# Altium schematic sheet ECU_AutoRC_STEMP_r00.SchDoc
size A4; SheetNumber: 5; SheetTotal: 9
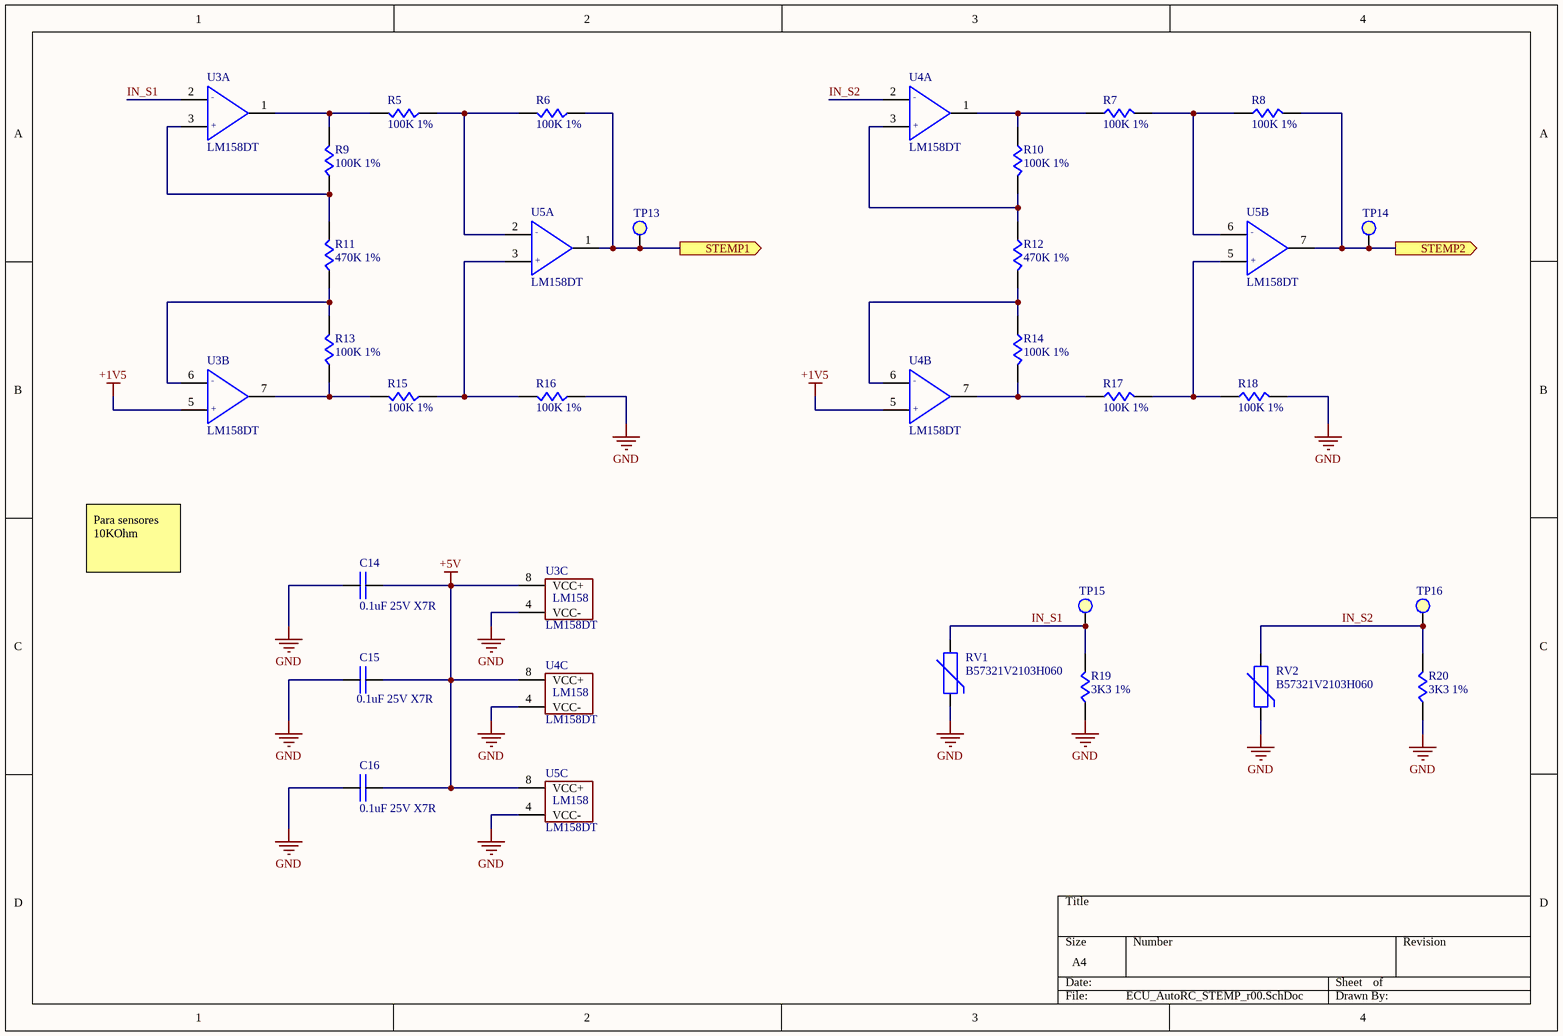
[diagram p0: ECU_AutoRC_STEMP_r00.SchDoc]

## Parts
C14  0.1uF 25V X7R  [C_0805]
C15  0.1uF 25V X7R  [C_0805]
C16  0.1uF 25V X7R  [C_0805]
R5  100K 1%  [R_0805]
R6  100K 1%  [R_0805]
R7  100K 1%  [R_0805]
R8  100K 1%  [R_0805]
R9  100K 1%  [R_0805]
R10  100K 1%  [R_0805]
R11  470K 1%  [R_0805]
R12  470K 1%  [R_0805]
R13  100K 1%  [R_0805]
R14  100K 1%  [R_0805]
R15  100K 1%  [R_0805]
R16  100K 1%  [R_0805]
R17  100K 1%  [R_0805]
R18  100K 1%  [R_0805]
R19  3K3 1%  [R_0805]
R20  3K3 1%  [R_0805]
RV1  B57321V2103H060  [R_0603]
RV2  B57321V2103H060  [R_0603]
TP13  Test Point  [TEST_POINT]  (value not drawn)
TP14  Test Point  [TEST_POINT]  (value not drawn)
TP15  Test Point  [TEST_POINT]  (value not drawn)
TP16  Test Point  [TEST_POINT]  (value not drawn)
U3  LM158DT  [IC_SO8]  (parts A,B,C of 3)
U4  LM158DT  [IC_SO8]  (parts A,B,C of 3)
U5  LM158DT  [IC_SO8]  (parts A,B,C of 3)

## Ports
STEMP1 (out, see ECU_AutoRC_BLK_r00[4B], ECU_AutoRC_UC1_r00[1B]), STEMP2 (out, see ECU_AutoRC_BLK_r00[4B], ECU_AutoRC_UC1_r00[1B])

## Nets
+1V5: U3.5(IN2+) U4.5(IN2+)
+5V: C14.1 C15.1 C16.1 U3.8(VCC+) U4.8(VCC+) U5.8(VCC+)
GND: C14.2 C15.2 C16.2 R16.1 R18.2 R19.1 R20.1 RV1.1 RV2.1 U3.4(VCC-) U4.4(VCC-) U5.4(VCC-)
IN_S1: R19.2 RV1.2 TP15.1 U3.2(IN1-)
IN_S2: R20.2 RV2.2 TP16.1 U4.2(IN1-)
STEMP1: R6.1 TP13.1 U5.1(OUT1) ; port STEMP1
STEMP2: R8.2 TP14.1 U5.7(OUT2) ; port STEMP2
NetR5_1: R5.1 R6.2 U5.2(IN1-)
NetR5_2: R5.2 R9.2 U3.1(OUT1)
NetR7_1: R7.1 R10.1 U4.1(OUT1)
NetR7_2: R7.2 R8.1 U5.6(IN2-)
NetR9_1: R9.1 R11.2 U3.3(IN1+)
NetR10_2: R10.2 R12.1 U4.3(IN1+)
NetR11_1: R11.1 R13.2 U3.6(IN2-)
NetR12_2: R12.2 R14.1 U4.6(IN2-)
NetR13_1: R13.1 R15.2 U3.7(OUT2)
NetR14_2: R14.2 R17.1 U4.7(OUT2)
NetR15_1: R15.1 R16.2 U5.3(IN1+)
NetR17_2: R17.2 R18.1 U5.5(IN2+)

## Notes on the sheet
- Para sensores 10KOhm
- (in symbol LM158, part A) -; +
- (in symbol LM158, part B) -; +

## Library data of the parts
C14-C16 = Capacitor NP: Non Polarizated Capacitor
R5-R20 = Resistor
RV1 RV2 = Thermistor
TP13-TP16 = TestPoint
U3-U5 = LM158: Intrumentation Amplifier